# Altium project Q24_Steering_Wheel_Pi.PrjPcb
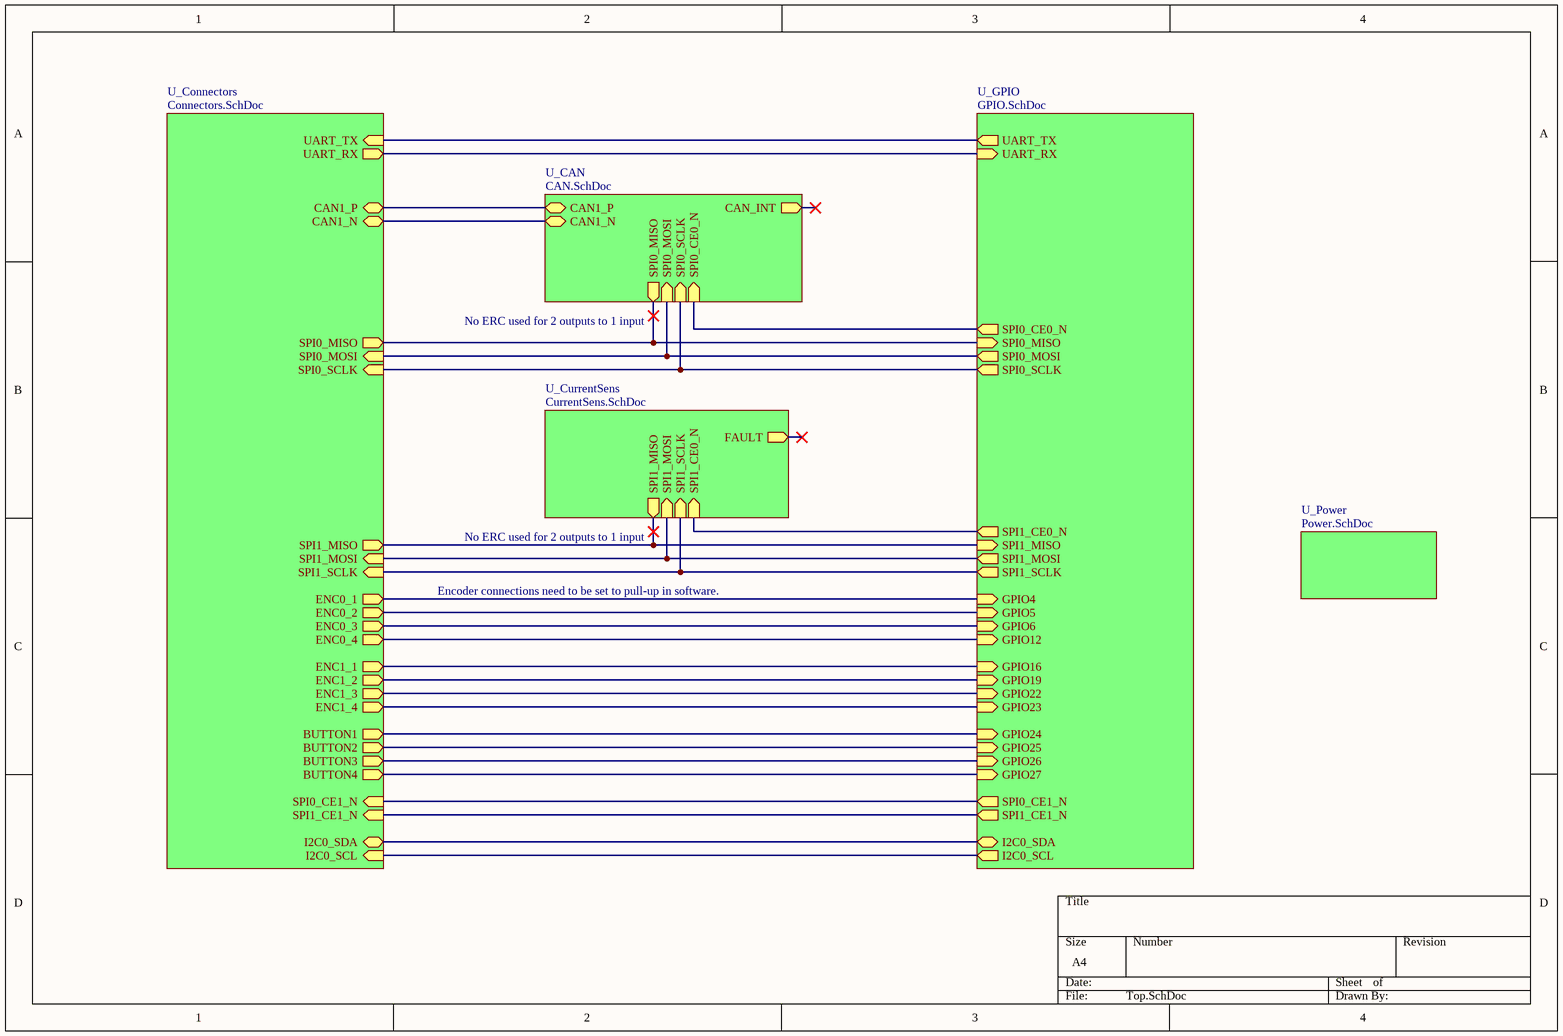
[diagram p0: Top.SchDoc]
6 sheets, 45 parts. Net scope: hierarchical (ports join the sheet entries above them; power ports are global).
Board file: RPI 3.PcbDoc
Sheets:
  Top.SchDoc
    U_GPIO = GPIO.SchDoc
    U_CAN = CAN.SchDoc
    U_CurrentSens = CurrentSens.SchDoc
    U_Power = Power.SchDoc
    U_Connectors = Connectors.SchDoc

## Sheet Top.SchDoc
size A4; SheetNumber: 1; SheetTotal: 6

### Sub-sheets
U_CAN = CAN.SchDoc: CAN1_P (bidir), CAN1_N (bidir), CAN_INT (out), SPI0_CE0_N (in), SPI0_SCLK (in), SPI0_MOSI (in), SPI0_MISO (out)
U_Connectors = Connectors.SchDoc: ENC0_1 (out), ENC0_2 (out), ENC0_4 (out), ENC0_3 (out), ENC1_1 (out), ENC1_3 (out), ENC1_2 (out), ENC1_4 (out), BUTTON1 (out), BUTTON3 (out), BUTTON4 (out), BUTTON2 (out), I2C0_SDA (bidir), I2C0_SCL (in), CAN1_P (bidir), CAN1_N (bidir), UART_TX (in), UART_RX (out), SPI0_MOSI (in), SPI0_MISO (out), SPI0_CE1_N (in), SPI0_SCLK (in), SPI1_SCLK (in), SPI1_CE1_N (in), SPI1_MISO (out), SPI1_MOSI (in)
U_CurrentSens = CurrentSens.SchDoc: SPI1_MISO (out), SPI1_CE0_N (in), SPI1_SCLK (in), SPI1_MOSI (in), FAULT (out)
U_GPIO = GPIO.SchDoc: I2C0_SDA (bidir), I2C0_SCL (out), GPIO4 (in), SPI1_CE1_N (out), GPIO27 (in), GPIO22 (in), SPI0_MOSI (out), SPI0_MISO (in), SPI0_SCLK (out), GPIO26 (in), GPIO19 (in), GPIO6 (in), GPIO5 (in), SPI1_MISO (in), SPI1_MOSI (out), SPI0_CE1_N (out), SPI1_SCLK (out), SPI0_CE0_N (out), UART_RX (in), UART_TX (out), GPIO23 (in), GPIO24 (in), GPIO25 (in), GPIO12 (in), GPIO16 (in), SPI1_CE0_N (out)
U_Power = Power.SchDoc: no entries

### Nets
CAN1_N: sheet U_CAN/CAN1_N, sheet U_Connectors/CAN1_N
CAN1_P: sheet U_CAN/CAN1_P, sheet U_Connectors/CAN1_P
GPIO4: sheet U_GPIO/GPIO4, sheet U_Connectors/ENC0_1
GPIO5: sheet U_GPIO/GPIO5, sheet U_Connectors/ENC0_2
GPIO6: sheet U_GPIO/GPIO6, sheet U_Connectors/ENC0_3
GPIO12: sheet U_GPIO/GPIO12, sheet U_Connectors/ENC0_4
GPIO16: sheet U_GPIO/GPIO16, sheet U_Connectors/ENC1_1
GPIO19: sheet U_GPIO/GPIO19, sheet U_Connectors/ENC1_2
GPIO22: sheet U_GPIO/GPIO22, sheet U_Connectors/ENC1_3
GPIO23: sheet U_GPIO/GPIO23, sheet U_Connectors/ENC1_4
GPIO24: sheet U_GPIO/GPIO24, sheet U_Connectors/BUTTON1
GPIO25: sheet U_GPIO/GPIO25, sheet U_Connectors/BUTTON2
GPIO26: sheet U_GPIO/GPIO26, sheet U_Connectors/BUTTON3
GPIO27: sheet U_GPIO/GPIO27, sheet U_Connectors/BUTTON4
I2C0_SCL: sheet U_GPIO/I2C0_SCL, sheet U_Connectors/I2C0_SCL
I2C0_SDA: sheet U_GPIO/I2C0_SDA, sheet U_Connectors/I2C0_SDA
SPI0_CE0_N: sheet U_GPIO/SPI0_CE0_N, sheet U_CAN/SPI0_CE0_N
SPI0_CE1_N: sheet U_GPIO/SPI0_CE1_N, sheet U_Connectors/SPI0_CE1_N
SPI0_MISO: sheet U_GPIO/SPI0_MISO, sheet U_CAN/SPI0_MISO, sheet U_Connectors/SPI0_MISO
SPI0_MOSI: sheet U_GPIO/SPI0_MOSI, sheet U_CAN/SPI0_MOSI, sheet U_Connectors/SPI0_MOSI
SPI0_SCLK: sheet U_GPIO/SPI0_SCLK, sheet U_CAN/SPI0_SCLK, sheet U_Connectors/SPI0_SCLK
SPI01_CE0_N: sheet U_GPIO/SPI1_CE0_N, sheet U_CurrentSens/SPI1_CE0_N
SPI1_CE1_N: sheet U_GPIO/SPI1_CE1_N, sheet U_Connectors/SPI1_CE1_N
SPI1_MISO: sheet U_GPIO/SPI1_MISO, sheet U_CurrentSens/SPI1_MISO, sheet U_Connectors/SPI1_MISO
SPI1_MOSI: sheet U_GPIO/SPI1_MOSI, sheet U_CurrentSens/SPI1_MOSI, sheet U_Connectors/SPI1_MOSI
SPI1_SCLK: sheet U_GPIO/SPI1_SCLK, sheet U_CurrentSens/SPI1_SCLK, sheet U_Connectors/SPI1_SCLK
UART_RX: sheet U_GPIO/UART_RX, sheet U_Connectors/UART_RX
UART_TX: sheet U_GPIO/UART_TX, sheet U_Connectors/UART_TX

### Notes on the sheet
- No ERC used for 2 outputs to 1 input
- Encoder connections need to be set to pull-up in software.

## Sheet GPIO.SchDoc
size A4; SheetNumber: 6; SheetTotal: 6
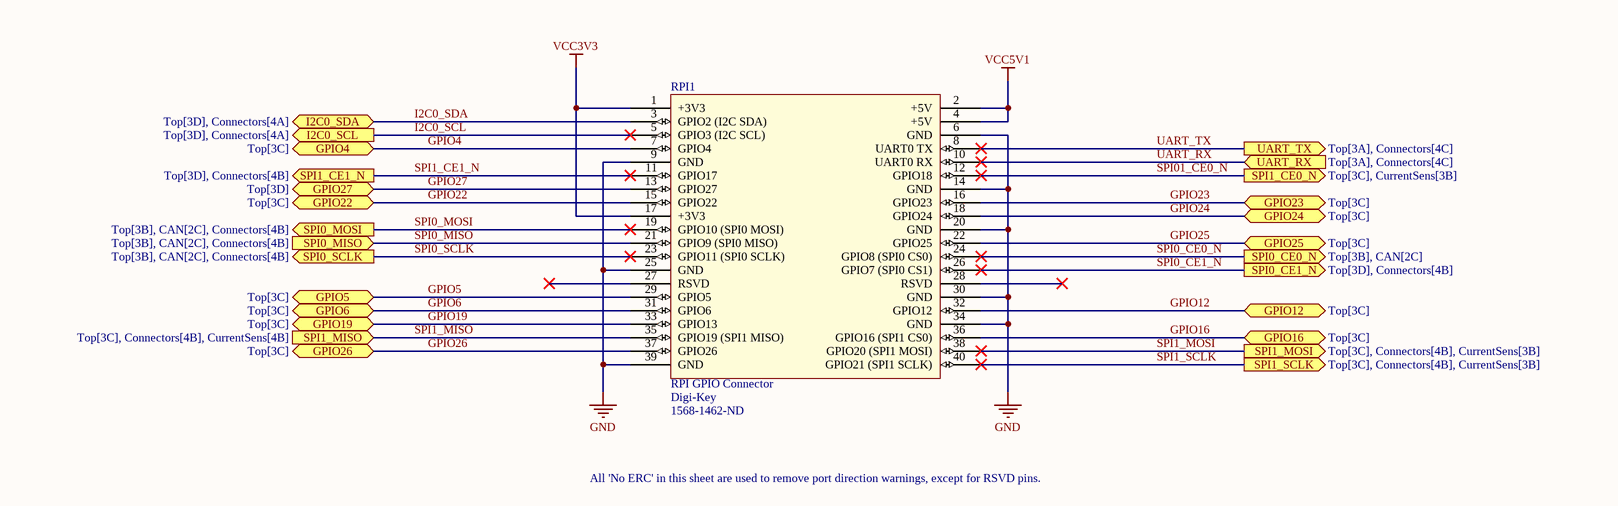
[diagram p1: GPIO.SchDoc]

### Parts
RPI1  RPI GPIO Connector  Supplier 1: Digi-Key  Supplier Part Number 1: 1568-1462-ND  [rpi]

### Ports
GPIO4 (bidir, see Top[3C]), GPIO5 (bidir, see Top[3C]), GPIO6 (bidir, see Top[3C]), GPIO12 (bidir, see Top[3C]), GPIO16 (bidir, see Top[3C]), GPIO19 (bidir, see Top[3C]), GPIO22 (bidir, see Top[3C]), GPIO23 (bidir, see Top[3C]), GPIO24 (bidir, see Top[3C]), GPIO25 (bidir, see Top[3C]), GPIO26 (bidir, see Top[3C]), GPIO27 (bidir, see Top[3D]), I2C0_SCL (out, see Top[3D], Connectors[4A]), I2C0_SDA (bidir, see Top[3D], Connectors[4A]), SPI0_CE0_N (out, see Top[3B], CAN[2C]), SPI0_CE1_N (out, see Top[3D], Connectors[4B]), SPI0_MISO (in, see Top[3B], CAN[2C], Connectors[4B]), SPI0_MOSI (out, see Top[3B], CAN[2C], Connectors[4B]), SPI0_SCLK (out, see Top[3B], CAN[2C], Connectors[4B]), SPI1_CE0_N (out, see Top[3C], CurrentSens[3B]), SPI1_CE1_N (out, see Top[3D], Connectors[4B]), SPI1_MISO (in, see Top[3C], Connectors[4B], CurrentSens[4B]), SPI1_MOSI (out, see Top[3C], Connectors[4B], CurrentSens[3B]), SPI1_SCLK (out, see Top[3C], Connectors[4B], CurrentSens[3B]), UART_RX (in, see Top[3A], Connectors[4C]), UART_TX (out, see Top[3A], Connectors[4C])

### Nets
GND: RPI1.6(GND) RPI1.9(GND) RPI1.14(GND) RPI1.20(GND) RPI1.25(GND) RPI1.30(GND) RPI1.34(GND) RPI1.39(GND)
VCC3V3: RPI1.1(+3V3) RPI1.17(+3V3)
VCC5V1: RPI1.2(+5V) RPI1.4(+5V)
GPIO4: RPI1.7(GPIO4) ; port GPIO4
GPIO5: RPI1.29(GPIO5) ; port GPIO5
GPIO6: RPI1.31(GPIO6) ; port GPIO6
GPIO12: RPI1.32(GPIO12) ; port GPIO12
GPIO16: RPI1.36(GPIO16_(SPI1_CS0)) ; port GPIO16
GPIO19: RPI1.33(GPIO13) ; port GPIO19
GPIO22: RPI1.15(GPIO22) ; port GPIO22
GPIO23: RPI1.16(GPIO23) ; port GPIO23
GPIO24: RPI1.18(GPIO24) ; port GPIO24
GPIO25: RPI1.22(GPIO25) ; port GPIO25
GPIO26: RPI1.37(GPIO26) ; port GPIO26
GPIO27: RPI1.13(GPIO27) ; port GPIO27
I2C0_SCL: RPI1.5(GPIO3_(I2C_SCL)) ; port I2C0_SCL
I2C0_SDA: RPI1.3(GPIO2_(I2C_SDA)) ; port I2C0_SDA
SPI0_CE0_N: RPI1.24(GPIO8_(SPI0_CS0)) ; port SPI0_CE0_N
SPI0_CE1_N: RPI1.26(GPIO7_(SPI0_CS1)) ; port SPI0_CE1_N
SPI0_MISO: RPI1.21(GPIO9_(SPI0_MISO)) ; port SPI0_MISO
SPI0_MOSI: RPI1.19(GPIO10_(SPI0_MOSI)) ; port SPI0_MOSI
SPI0_SCLK: RPI1.23(GPIO11_(SPI0_SCLK)) ; port SPI0_SCLK
SPI01_CE0_N: RPI1.12(GPIO18) ; port SPI1_CE0_N
SPI1_CE1_N: RPI1.11(GPIO17) ; port SPI1_CE1_N
SPI1_MISO: RPI1.35(GPIO19_(SPI1_MISO)) ; port SPI1_MISO
SPI1_MOSI: RPI1.38(GPIO20_(SPI1_MOSI)) ; port SPI1_MOSI
SPI1_SCLK: RPI1.40(GPIO21_(SPI1_SCLK)) ; port SPI1_SCLK
UART_RX: RPI1.10(UART0_RX) ; port UART_RX
UART_TX: RPI1.8(UART0_TX) ; port UART_TX

Not connected (* = marked no-connect by the designer): RPI1 27(RSVD)* 28(RSVD)*

### Notes on the sheet
- All 'No ERC' in this sheet are used to remove port direction warnings, except for RSVD pins.

### Library data of the parts
RPI1 = rpi connector: GPIO Header for Raspberry Pi A+/B+/Pi 2/Pi 3 - 2x20; Manufacturer: SparkFun Electronics; Manufacturer Part Number: PRT-14017; Nils Minor: author; nilsminor@web.de: mail; RoHS: RoHS Compliant; Category: Development Boards, Kits, Programmers; Stock 1: 150; Pricing 1: 1=1.84 (EUR); Part Status: Active; Accessory Type: Connector; For Use With/Related Products: Raspberry Pi; ComponentLink1URL: https://cdn.sparkfun.com/datasheets/Dev/RaspberryPi/12313.pdf; ComponentLink1Description: https://cdn.sparkfun.com/datasheets/Dev/RaspberryPi/12313.pdf

## Sheet CAN.SchDoc
size A4; SheetNumber: 3; SheetTotal: 6
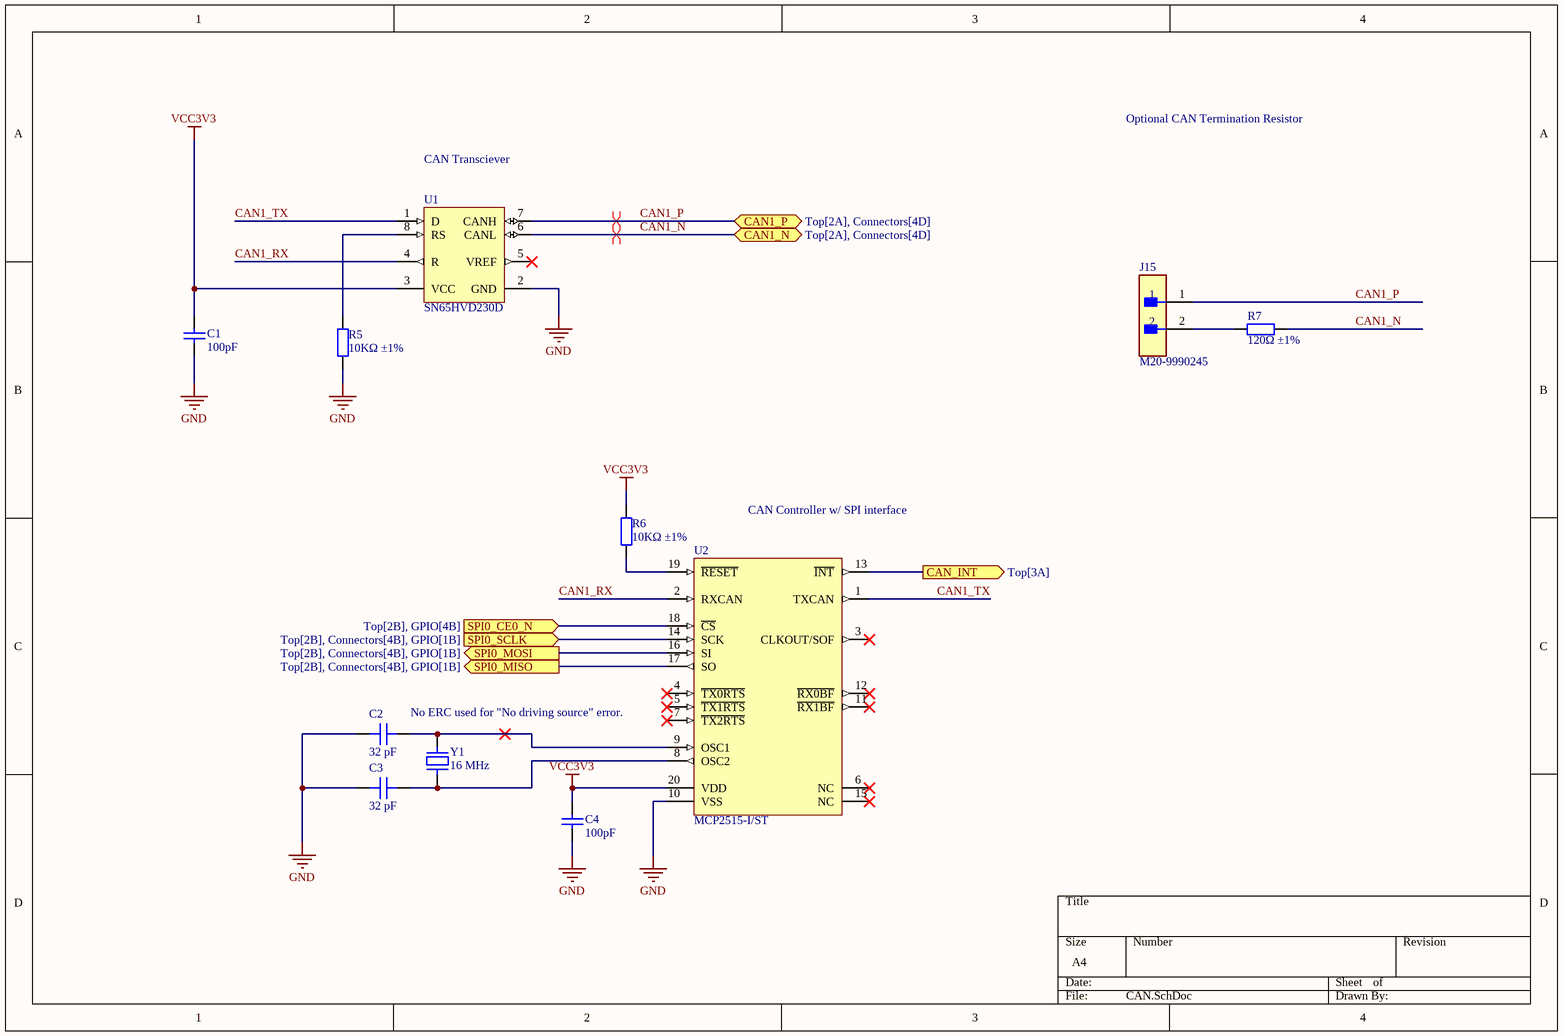
[diagram p2: CAN.SchDoc]

### Parts
C1  100pF  [0402_C]
C2  32 pF  [CAP 0603_1608]
C3  32 pF  [CAP 0603_1608]
C4  100pF  [0402_C]
J15  M20-9990245  [FP-M20-9990245-MFG]
R5  10KΩ ±1%  [0402_R]
R6  10KΩ ±1%  [0402_R]
R7  120Ω ±1%  [0603_R]
U1  SN65HVD230D  [D0008A_M]
U2  MCP2515-I/ST  [TSSOP-ST20_N]
Y1  16 MHz  [ABRACON ABLS]

### Ports
CAN1_N (bidir, see Top[2A], Connectors[4D]), CAN1_P (bidir, see Top[2A], Connectors[4D]), CAN_INT (out, see Top[3A]), SPI0_CE0_N (in, see Top[2B], GPIO[4B]), SPI0_MISO (out, see Top[2B], Connectors[4B], GPIO[1B]), SPI0_MOSI (out, see Top[2B], Connectors[4B], GPIO[1B]), SPI0_SCLK (in, see Top[2B], Connectors[4B], GPIO[1B])

### Nets
GND: C1.1 C2.1 C3.1 C4.1 R5.1 U1.2(GND) U2.10(VSS)
VCC3V3: C1.2 C4.2 R6.2 U1.3(VCC) U2.20(VDD)
CAN1_N: R7.1 U1.6(CANL) ; port CAN1_N
CAN1_P: J15.1 U1.7(CANH) ; port CAN1_P
CAN1_RX: U1.4(R) U2.2(RXCAN)
CAN1_TX: U1.1(D) U2.1(TXCAN)
SPI0_CE0_N: U2.18(~{CS}) ; port SPI0_CE0_N
SPI0_MISO: U2.17(SO) ; port SPI0_MISO
SPI0_MOSI: U2.16(SI) ; port SPI0_MOSI
SPI0_SCLK: U2.14(SCK) ; port SPI0_SCLK
NetC2_2: C2.2 U2.9(OSC1) Y1.2
NetC3_2: C3.2 U2.8(OSC2) Y1.1
NetJ15_2: J15.2 R7.2
NetR5_2: R5.2 U1.8(RS)
NetR6_1: R6.1 U2.19(~{RESET})
NetU2_13: U2.13(~{INT}) ; port CAN_INT

Not connected (* = marked no-connect by the designer): U1 5(VREF)*; U2 3(CLKOUT/SOF)* 4(~{TX0RTS})* 5(~{TX1RTS})* 6(NC)* 7(~{TX2RTS})* 11(~{RX1BF})* 12(~{RX0BF})* 15(NC)*

### Layout directives
differential pair: CAN1_N, CAN1_P

### Notes on the sheet
- CAN Transciever
- Optional CAN Termination Resistor
- CAN Controller w/ SPI interface
- No ERC used for "No driving source" error.

### Library data of the parts
C1 C4 = 0402 100pF (101) 5% 50V: Chip capacitors; Manufacturer: Guangdong Fenghua Advanced Tech; PartNumber: 0402CG101J500NT; Tolerance: 5%; Voltage: 50V; ComponentLink1Description: Supplier link; ComponentLink1URL: http://www.szlcsc.com/product/details_1898.html; Package: 0402; Supplier: LC; SuppliersPartNumber: C1546; Capacitance: 100pF
C2 C3 = 06031A320FAT2A: CAP CER 32PF 100V C0G/NP0 0603; manufacturer: KYOCERA AVX; Temperature Coefficient: C0G, NP0; Tolerance: ±1%; Part Number: 06031A320FAT2A; Value: 32 pF; Applications: General Purpose; Capacitance: 32 pF; componentlink1description: Datasheet; componentlink1url: https://datasheets.kyocera-avx.com/C0GNP0-Dielectric.pdf; componentlink2description: DigiKey Link; componentlink2url: https://www.digikey.com/en/products/detail/kyocera-avx/06031A320FAT2A/1598465; Device Package: 0603 (1608 Metric); lastupdated: 2023-12-31 8:09:49 PM; Lifecycle Status: Active; Minimum Order: 1; Mounting Type: Surface Mount, MLCC; Operating Temperature: -55°C ~ 125°C; Package / Case: 0603 (1608 Metric); packaging: TapeAndReel; partid: 40205; Part Status: Active; price: 0.07; series: -; Size / Dimension: 0.063" L x 0.032" W (1.60mm x 0.81mm); Supplier 1: DigiKey; Supplier Part Number 1: 478-06031A320FAT2ACT-ND; Thickness (Max): 0.035" (0.90mm); Voltage - Rated: 100V
J15 = CMP-15831-000105-1: CONN HEADER VERT 2POS 2.54MM; Working Voltage: 750V; Gender: Male; Number of Poles: 2; Current Rating: 3A; Mated Stacking Heights: 16.54mm; Contact Resistance: 25mR; Connector Type: Male Pin; Insulation Resistance: 10GR; Mating Cycles: 300; Voltage: 50V; Flammability Rating: UL94 V-0; Pitch: 2.54mm; Series: M20; Number of Contacts: 2; Height: 0.12inch; Min Operating Temperature: -40°C; Contact Finish - Mating: GOLD; Number of Positions: 2; Number of Rows: 1; Packaging: Bulk; Package Quantity: 1000; Voltage Rating (AC): 750V; Current: 3A; Mount: Through Hole; Case/Package: SIL; Orientation: Straight; Contact Shape: Square; Weight: 0.25lb; Radiation Hardening: No; Fastening Type: Pull; Length: 5.08mm; Depth: 2.54mm; Contact Mating Length: 0.24inch; Housing Material: Nylon; Reach SVHC Compliant: Yes; Insulation Material: Nylon; Color: Black; Width: 0.25inch; Insulation Color: Black; Contact Material: Brass; Contact Type: Male Pin; Termination: Solder; Max Operating Temperature: 105°C; Contact Plating: Gold; Housing Color: Black; Max Current Rating: 3A; Lead Pitch: 2.54mm
R5 R6 = 0402 10K (1002) 1%: Chip resistor; Manufacturer: Uniroyal Elec; PartNumber: 0402WGF1002TCE; Power: 1/16W; ComponentLink1Description: Supplier link; ComponentLink1URL: http://www.szlcsc.com/product/details_26487.html; Package: 0402; Supplier: LC; SuppliersPartNumber: C25744; Resistance: 10KΩ; Tolerance: 1%
R7 = 0603 120R (1200) 1%: Chip resistor; Manufacturer: Uniroyal Elec; PartNumber: 0603WAF1200T5E; Power: 1/10W; ComponentLink1Description: Supplier link; ComponentLink1URL: http://www.szlcsc.com/product/details_23514.html; Package: 0603; Supplier: LC; SuppliersPartNumber: C22787; Resistance: 120Ω; Tolerance: 1%
U1 = CMP-0315-00046-3: CAN Bus Transceiver, 3.3 V, -40 to 85 degC, 8-Pin SOIC (D), Green (RoHS & no Sb/Br), Tube; Supply Voltage Min: 3 V; Supply Voltage Max: 3.6 V; PartNumber: SN65HVD230D; ComponentLink2URL: http://www.ti.com/general/docs/lit/getliterature.tsp?genericGeneric Part Number=SN65HVD230&fileType=pdf; DatasheetVersion: SLOS346N; Generic Part Number: SN65HVD230; Packing: Tube; Temperature Min: -40 degC; Temperature Max: 85 degC; ComponentLink1Description: Manufacturer URL; Mounting Technology: Surface Mount; RoHS: TRUE; ComponentLink1URL: http://www.ti.com/; ComponentLink2Description: Datasheet; PackageDescription: 8-Pin Plastic Small Outline, Body 4.9 x 3.9 mm, Pitch 1.27 mm
U2 = CMP-0186-00077-2: Stand-Alone CAN Controller With SPI Interface, 20-Pin TSSOP, Industrial Temperature; DatasheetVersion: revF, Oct-2010; ComponentLink1Description: Manufacturer URL; PackageDescription: 20-Lead Plastic Thin Shrink Small Outline (ST) - 4.4mm Body [TSSOP]; ComponentLink1URL: http://www.microchip.com/; RevisionNote: URLs added. DatasheetVersion updated.; PackageReference: TSSOP-ST20; Code_JEDEC: MO-153-AC; ComponentLink2Description: Datasheet; ComponentLink2URL: http://ww1.microchip.com/downloads/en/DeviceDoc/21801f.pdf; PackageVersion: revBB, Aug-2009; ComponentLink3URL: http://www.microchip.com/stellent/groups/techpub_sg/documents/packagingspec/en012702.pdf; ComponentLink3Description: Package Specification
Y1 = ABLS-16.000MHZ-D-3-Y-T: CRYSTAL 16.0000MHZ 18PF SMD; Manufacturer: Abracon LLC; ESR (Equivalent Series Resistance): 40 Ohms; Frequency Stability: ±30ppm; Frequency Tolerance: ±25ppm; Operating Mode: Fundamental; Part Number: ABLS-16.000MHZ-D-3-Y-T; ComponentLink1Description: Datasheet; ComponentLink1URL: https://abracon.com/Resonators/abls.pdf; ComponentLink2Description: DigiKey Link; ComponentLink2URL: https://www.digikey.com/en/products/detail/abracon-llc/ABLS-16-000MHZ-D-3-Y-T/9997790; Frequency: 16 MHz; Height - Seated (Max): 0.165" (4.20mm); LastUpdated: 2023-12-31 9:29:55 PM; Lifecycle Status: Active; Load Capacitance: 18pF; Minimum Order: 1; Mounting Type: Surface Mount; Operating Temperature: -40°C ~ 85°C; Package / Case: HC-49/US; Packaging: TapeAndReel; PartId: 74; Part Status: Active; Price: 0.09; Series: ABLS; Size / Dimension: 0.449" L x 0.185" W (11.40mm x 4.70mm); Supplier 1: DigiKey; Supplier Part Number 1: 535-14882-1-ND; Type: MHz Crystal; Value: 16 MHz

## Sheet CurrentSens.SchDoc
size A4; SheetNumber: 5; SheetTotal: 6
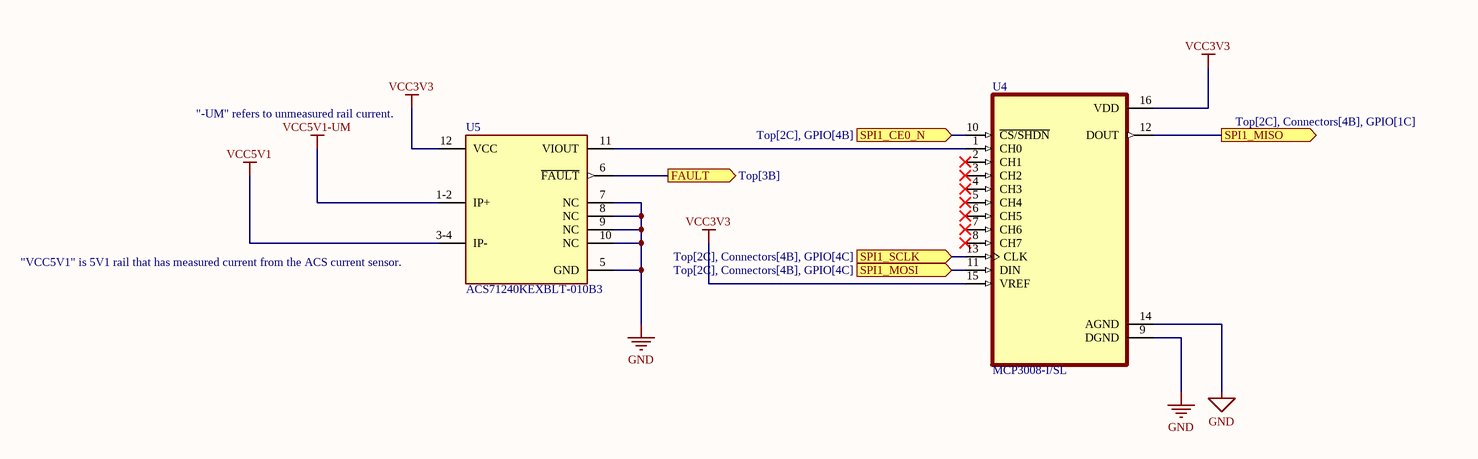
[diagram p3: CurrentSens.SchDoc]

### Parts
U4  MCP3008-I/SL  [SOIC127P600X175-16N]
U5  ACS71240KEXBLT-010B3  [FP-EXB-12-MFG]

### Ports
FAULT (out, see Top[3B]), SPI1_CE0_N (in, see Top[2C], GPIO[4B]), SPI1_MISO (out, see Top[2C], Connectors[4B], GPIO[1C]), SPI1_MOSI (in, see Top[2C], Connectors[4B], GPIO[4C]), SPI1_SCLK (in, see Top[2C], Connectors[4B], GPIO[4C])

### Nets
GND: U4.9(DGND) U4.14(AGND) U5.5(GND) U5.7(NC) U5.8(NC) U5.9(NC) U5.10(NC)
VCC3V3: U4.15(VREF) U4.16(VDD) U5.12(VCC)
VCC5V1: U5.3-4(IP-)
VCC5V1-UM: U5.1-2(IP+)
SPI01_CE0_N: U4.10(~{CS/SHDN}) ; port SPI1_CE0_N
SPI1_MISO: U4.12(DOUT) ; port SPI1_MISO
SPI1_MOSI: U4.11(DIN) ; port SPI1_MOSI
SPI1_SCLK: U4.13(CLK) ; port SPI1_SCLK
NetU4_1: U4.1(CH0) U5.11(VIOUT)
NetU5_6: U5.6(~{FAULT}) ; port FAULT

Not connected (* = marked no-connect by the designer): U4 2(CH1)* 3(CH2)* 4(CH3)* 5(CH4)* 6(CH5)* 7(CH6)* 8(CH7)*

### Notes on the sheet
- (near U5) "-UM" refers to unmeasured rail current.
- (near U5) "VCC5V1" is 5V1 rail that has measured current from the ACS current sensor.

### Library data of the parts
U4 = MCP3008-I/SL: 10 Bit Analog to Digital Converter 4, 8 Input 1 SAR 16-SOIC; MF: Microchip; Value: *; Price: None; Package: SOIC-16 Microchip; Check_prices: https://www.snapeda.com/parts/MCP3008-I/SL/Microchip/view-part/?ref=eda; Availability: In Stock; SnapEDA_Link: https://www.snapeda.com/parts/MCP3008-I/SL/Microchip/view-part/?ref=snap; MP: MCP3008-I/SL; Purchase-URL: https://pricing.snapeda.com/search/part/MCP3008-I/SL/?ref=eda
U5 = CMP-82923-000018-1: AUTOMOTIVE-GRADE, GALVANICALLY I

## Sheet Power.SchDoc
size A4; SheetNumber: 4; SheetTotal: 6
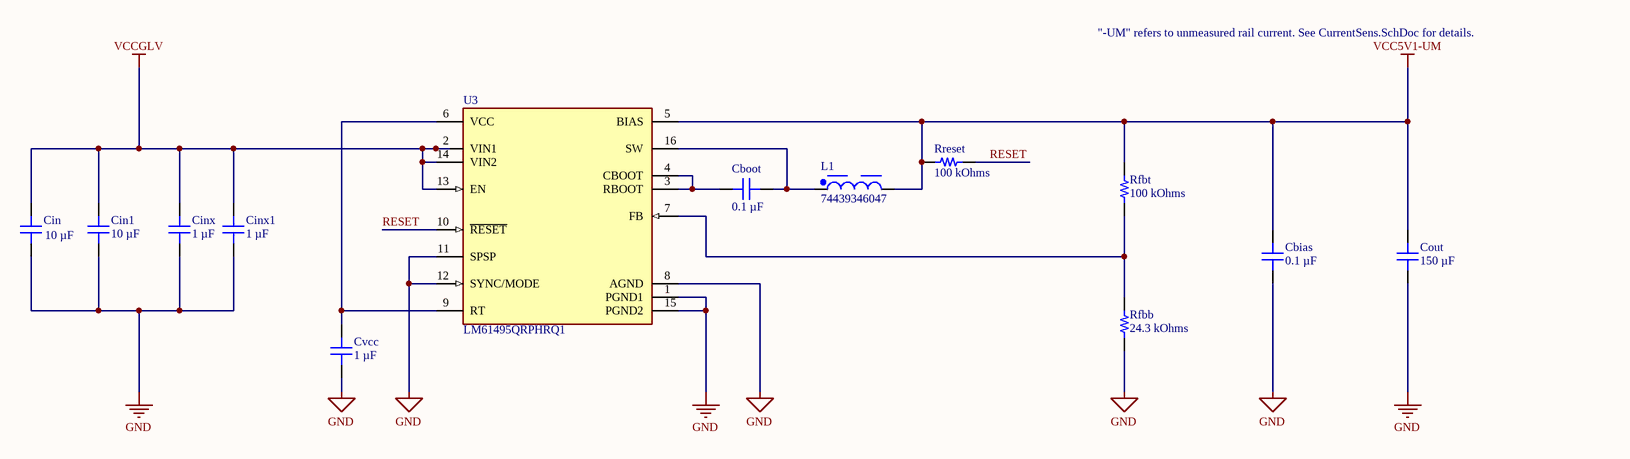
[diagram p4: Power.SchDoc]

### Parts
Cbias  0.1 µF  [CAP 0402_1005]
Cboot  0.1 µF  [CAP 0402_1005]
Cin  10 µF  [CAP 1210_3225 - 1MM]
Cin1  10 µF  [CAP 1210_3225 - 1MM]
Cinx  1 µF  [CAP 0603_1608]
Cinx1  1 µF  [CAP 0603_1608]
Cout  150 µF  [CAP 1210_3225 - 1MM]
Cvcc  1 µF  [CAP 0603_1608]
L1  74439346047  [WE-XHMI_6060_L6.65W6.45H5.8]
Rfbb  24.3 kOhms  [RES 0402_1005]
Rfbt  100 kOhms  [RES 0402_1005]
Rreset  100 kOhms  [RES 0402_1005]
U3  LM61495QRPHRQ1  [FP-RPH0016A-MFG]

### Nets
GND: Cbias.1 Cin.1 Cin1.1 Cinx.1 Cinx1.1 Cout.1 Cvcc.1 Rfbb.1 U3.1(PGND1) U3.8(AGND) U3.11(SPSP) U3.12(SYNC/MODE) U3.15(PGND2)
VCC5V1-UM: Cbias.2 Cout.2 L1.2 Rfbt.2 Rreset.1 U3.5(BIAS)
VCCGLV: Cin.2 Cin1.2 Cinx.2 Cinx1.2 U3.2(VIN1) U3.13(EN) U3.14(VIN2)
RESET: Rreset.2 U3.10(~{RESET})
NetCboot_1: Cboot.1 U3.3(RBOOT) U3.4(CBOOT)
NetCboot_2: Cboot.2 L1.1 U3.16(SW)
NetCvcc_2: Cvcc.2 U3.6(VCC) U3.9(RT)
NetRfbb_2: Rfbb.2 Rfbt.1 U3.7(FB)

### Notes on the sheet
- "-UM" refers to unmeasured rail current. See CurrentSens.SchDoc for details.

### Library data of the parts
Cbias = CL05B104KO5NFNC: CAP CER 0.1UF 16V X7R 0402; manufacturer: Samsung Electro-Mechanics; Tolerance: ±10%; Part Number: CL05B104KO5NFNC; Value: 0.1 µF; Applications: General Purpose; Capacitance: 0.1 µF; componentlink1description: Datasheet; componentlink1url: http://www.samsungsem.com/kr/support/product-search/mlcc/CL05B104KO5NFNC.jsp; componentlink2description: DigiKey Link; componentlink2url: https://www.digikey.com/en/products/detail/samsung-electro-mechanics/CL05B104KO5NFNC/3887166; Device Package: 0402 (1005 Metric); lastupdated: 2023-12-31 8:04:20 PM; Lifecycle Status: Active; Minimum Order: 1; Mounting Type: Surface Mount, MLCC; Operating Temperature: -55°C ~ 125°C; Package / Case: 0402 (1005 Metric); packaging: CutTape; partid: 11675; Part Status: Active; price: 0.01; series: CL; Size / Dimension: 0.039" L x 0.020" W (1.00mm x 0.50mm); Supplier 1: DigiKey; Supplier Part Number 1: 1276-1508-1-ND; Temperature Coefficient: X7R; Thickness (Max): 0.022" (0.55mm); Voltage - Rated: 16V
Cboot = CL05B104KP5NNNC: CAP CER 0.1UF 10V X7R 0402; manufacturer: Samsung Electro-Mechanics; Tolerance: ±10%; Part Number: CL05B104KP5NNNC; Value: 0.1 µF; Applications: General Purpose; Capacitance: 0.1 µF; componentlink1description: Datasheet; componentlink1url: http://www.samsungsem.com/kr/support/product-search/mlcc/CL05B104KP5NNNC.jsp; componentlink2description: DigiKey Link; componentlink2url: https://www.digikey.com/en/products/detail/samsung-electro-mechanics/CL05B104KP5NNNC/3886660; Device Package: 0402 (1005 Metric); lastupdated: 2023-12-31 8:04:29 PM; Lifecycle Status: Active; Minimum Order: 1; Mounting Type: Surface Mount, MLCC; Operating Temperature: -55°C ~ 125°C; Package / Case: 0402 (1005 Metric); packaging: CutTape; partid: 6068; Part Status: Active; price: 0.01; series: CL; Size / Dimension: 0.039" L x 0.020" W (1.00mm x 0.50mm); Supplier 1: DigiKey; Supplier Part Number 1: 1276-1002-1-ND; Temperature Coefficient: X7R; Thickness (Max): 0.022" (0.55mm); Voltage - Rated: 10V
Cin Cin1 = GRM32ER71H106KA12L: CAP CER 10UF 50V X7R 1210; manufacturer: Murata Electronics; Tolerance: ±10%; Part Number: GRM32ER71H106KA12L; Value: 10 µF; Applications: General Purpose; Capacitance: 10 µF; componentlink1description: Datasheet; componentlink1url: https://www.murata.com/~/media/webrenewal/support/library/catalog/products/capacitor/mlcc/c02e.ashx?la=en-us; componentlink2description: DigiKey Link; componentlink2url: https://www.digikey.com/en/products/detail/murata-electronics/GRM32ER71H106KA12L/2548481; Device Package: 1210 (3225 Metric); lastupdated: 2023-12-31 8:40:05 PM; Lifecycle Status: Active; Minimum Order: 1; Mounting Type: Surface Mount, MLCC; Operating Temperature: -55°C ~ 125°C; Package / Case: 1210 (3225 Metric); packaging: TapeAndReel; partid: 49713; Part Status: Active; price: 0.34; series: GRM; Size / Dimension: 0.126" L x 0.098" W (3.20mm x 2.50mm); Supplier 1: DigiKey; Supplier Part Number 1: 490-6544-1-ND; Temperature Coefficient: X7R; Thickness (Max): 0.106" (2.70mm); Voltage - Rated: 50V
Cinx Cinx1 = C1608X5R1H105K080AB: CAP CER 1UF 50V X5R 0603; manufacturer: TDK Corporation; Tolerance: ±10%; Part Number: C1608X5R1H105K080AB; Value: 1 µF; Applications: General Purpose; Capacitance: 1 µF; componentlink1description: Datasheet; componentlink1url: https://product.tdk.com/info/en/catalog/datasheets/mlcc_commercial_general_en.pdf?ref_disty=digikey; componentlink2description: DigiKey Link; componentlink2url: https://www.digikey.com/en/products/detail/tdk-corporation/C1608X5R1H105K080AB/2732903; Device Package: 0603 (1608 Metric); Features: Low ESL; lastupdated: 2023-12-31 8:10:04 PM; Lifecycle Status: Active; Minimum Order: 1; Mounting Type: Surface Mount, MLCC; Operating Temperature: -55°C ~ 85°C; Package / Case: 0603 (1608 Metric); packaging: TapeAndReel; partid: 36337; Part Status: Active; price: 0.02; series: C; Size / Dimension: 0.063" L x 0.031" W (1.60mm x 0.80mm); Supplier 1: DigiKey; Supplier Part Number 1: 445-7468-1-ND; Temperature Coefficient: X5R; Thickness (Max): 0.035" (0.90mm); Voltage - Rated: 50V
Cout = CL32A157MQVNNNE: CAP CER 150UF 6.3V X5R 1210; manufacturer: Samsung Electro-Mechanics; Tolerance: ±20%; Part Number: CL32A157MQVNNNE; Value: 150 µF; Applications: General Purpose; Capacitance: 150 µF; componentlink1description: Datasheet; componentlink1url: http://www.samsungsem.com/kr/support/product-search/mlcc/CL32A157MQVNNNE.jsp; componentlink2description: DigiKey Link; componentlink2url: https://www.digikey.com/en/products/detail/samsung-electro-mechanics/CL32A157MQVNNNE/3889025; Device Package: 1210 (3225 Metric); lastupdated: 2023-12-31 8:40:03 PM; Lifecycle Status: Active; Minimum Order: 1; Mounting Type: Surface Mount, MLCC; Operating Temperature: -55°C ~ 85°C; Package / Case: 1210 (3225 Metric); packaging: TapeAndReel; partid: 23856; Part Status: Active; price: 0.35; series: CL; Size / Dimension: 0.126" L x 0.098" W (3.20mm x 2.50mm); Supplier 1: DigiKey; Supplier Part Number 1: 1276-3367-1-ND; Temperature Coefficient: X5R; Thickness (Max): 0.110" (2.80mm); Voltage - Rated: 6.3V
Cvcc = KGM15BR50J105KT: CAP CER 1UF 6.3V X5R 0603; manufacturer: KYOCERA AVX; Tolerance: ±10%; Part Number: KGM15BR50J105KT; Value: 1 µF; Applications: General Purpose; Capacitance: 1 µF; componentlink1description: Datasheet; componentlink1url: https://datasheets.kyocera-avx.com/cx5r.pdf; componentlink2description: DigiKey Link; componentlink2url: https://www.digikey.com/en/products/detail/kyocera-avx/KGM15BR50J105KT/717509; Device Package: 0603 (1608 Metric); lastupdated: 2023-12-31 8:09:09 PM; Lifecycle Status: Active; Minimum Order: 1; Mounting Type: Surface Mount, MLCC; Operating Temperature: -55°C ~ 85°C; Package / Case: 0603 (1608 Metric); packaging: TapeAndReel; partid: 53227; Part Status: Active; price: 0.02; series: KGM - X5R; Size / Dimension: 0.063" L x 0.031" W (1.60mm x 0.80mm); Supplier 1: DigiKey; Supplier Part Number 1: 478-KGM15BR50J105KTCT-ND; Temperature Coefficient: X5R; Thickness (Max): 0.037" (0.95mm); Voltage - Rated: 6.3V
L1 = CMP-207846-000039-2: FIXED IND 4.7UH 7.4A 13 MOHM; NexarPartId: 75811200; Test Frequency: 100kHz; Saturation Current: 6.5A; Inductance Tolerance: 20%; Self Resonant Frequency: 25MHz; Series Resistance: 13mΩ; Inductance: 4.7µH; Width: 6.45mm; Mount: Surface Mount; Ambient Temperature Range High: 85°C; Max Operating Temperature: 125°C; RMS Current (Irms): 7.4A; Length: 6.65mm; Height: 6.1mm; RoHS: Compliant; REACH SVHC: No SVHC; DC Resistance (DCR): 13mΩ; Current Rating: 7.4A; Tolerance: 20%; Ambient Temperature Range Low: -40°C; Min Operating Temperature: -40°C; Composition: Wirewound; Number of Pins: 2
Rfbb = CRCW040224K3FKTD: RES SMD 24.3K OHM 1% 1/16W 0402; Manufacturer: Vishay Dale; Power (Watts): 0.063W, 1/16W; Temperature Coefficient: ±100ppm/°C; Part Number: CRCW040224K3FKTD; Value: 24.3 kOhms; ComponentLink1Description: Datasheet; ComponentLink1URL: https://www.vishay.com/docs/20008/dcrcw.pdf; ComponentLink2Description: DigiKey Link; ComponentLink2URL: https://www.digikey.com/en/products/detail/vishay-dale/CRCW040224K3FKTD/1221116; Composition: Thick Film; Device Package: 0402 (1005 Metric); Features: Automotive AEC-Q200; Height - Seated (Max): 0.016" (0.40mm); LastUpdated: 2023-12-31 8:26:27 PM; Lifecycle Status: Active; Minimum Order: 1; Number of Terminations: 2; Operating Temperature: -55°C ~ 155°C; Package / Case: 0402 (1005 Metric); Packaging: TapeAndReel; PartId: 81813; Price: 0.01; Ratings: AEC-Q200; Resistance: 24.3 kOhms; Series: CRCW; Size / Dimension: 0.039" L x 0.020" W (1.00mm x 0.50mm); Supplier 1: DigiKey; Supplier Part Number 1: 541-CRCW040224K3FKTDCT-ND; Supplier Device Package: 0402; Tolerance: ±1%
Rfbt Rreset = CRCW0402100KFKED: RES SMD 100K OHM 1% 1/16W 0402; Manufacturer: Vishay Dale; Power (Watts): 0.063W, 1/16W; Temperature Coefficient: ±100ppm/°C; Part Number: CRCW0402100KFKED; Value: 100 kOhms; ComponentLink1Description: Datasheet; ComponentLink1URL: http://www.vishay.com/docs/20035/dcrcwe3.pdf; ComponentLink2Description: DigiKey Link; ComponentLink2URL: https://www.digikey.com/en/products/detail/vishay-dale/CRCW0402100KFKED/1178235; Composition: Thick Film; Device Package: 0402 (1005 Metric); Features: Automotive AEC-Q200; Height - Seated (Max): 0.016" (0.40mm); LastUpdated: 2023-12-31 8:27:39 PM; Lifecycle Status: Active; Minimum Order: 1; Number of Terminations: 2; Operating Temperature: -55°C ~ 155°C; Package / Case: 0402 (1005 Metric); Packaging: CutTape; PartId: 11959; Part Status: Active; Price: 0.01; Ratings: AEC-Q200; Resistance: 100 kOhms; Series: CRCW; Size / Dimension: 0.039" L x 0.020" W (1.00mm x 0.50mm); Supplier 1: DigiKey; Supplier Part Number 1: 541-100KLCT-ND; Supplier Device Package: 0402; Tolerance: ±1%
U3 = CMP-04918-000418-1: 10-A automotive buck converter optimized for power density and low EMI 16-VQFN-HR -40 to 150

## Sheet Connectors.SchDoc
size A4; SheetNumber: 2; SheetTotal: 6
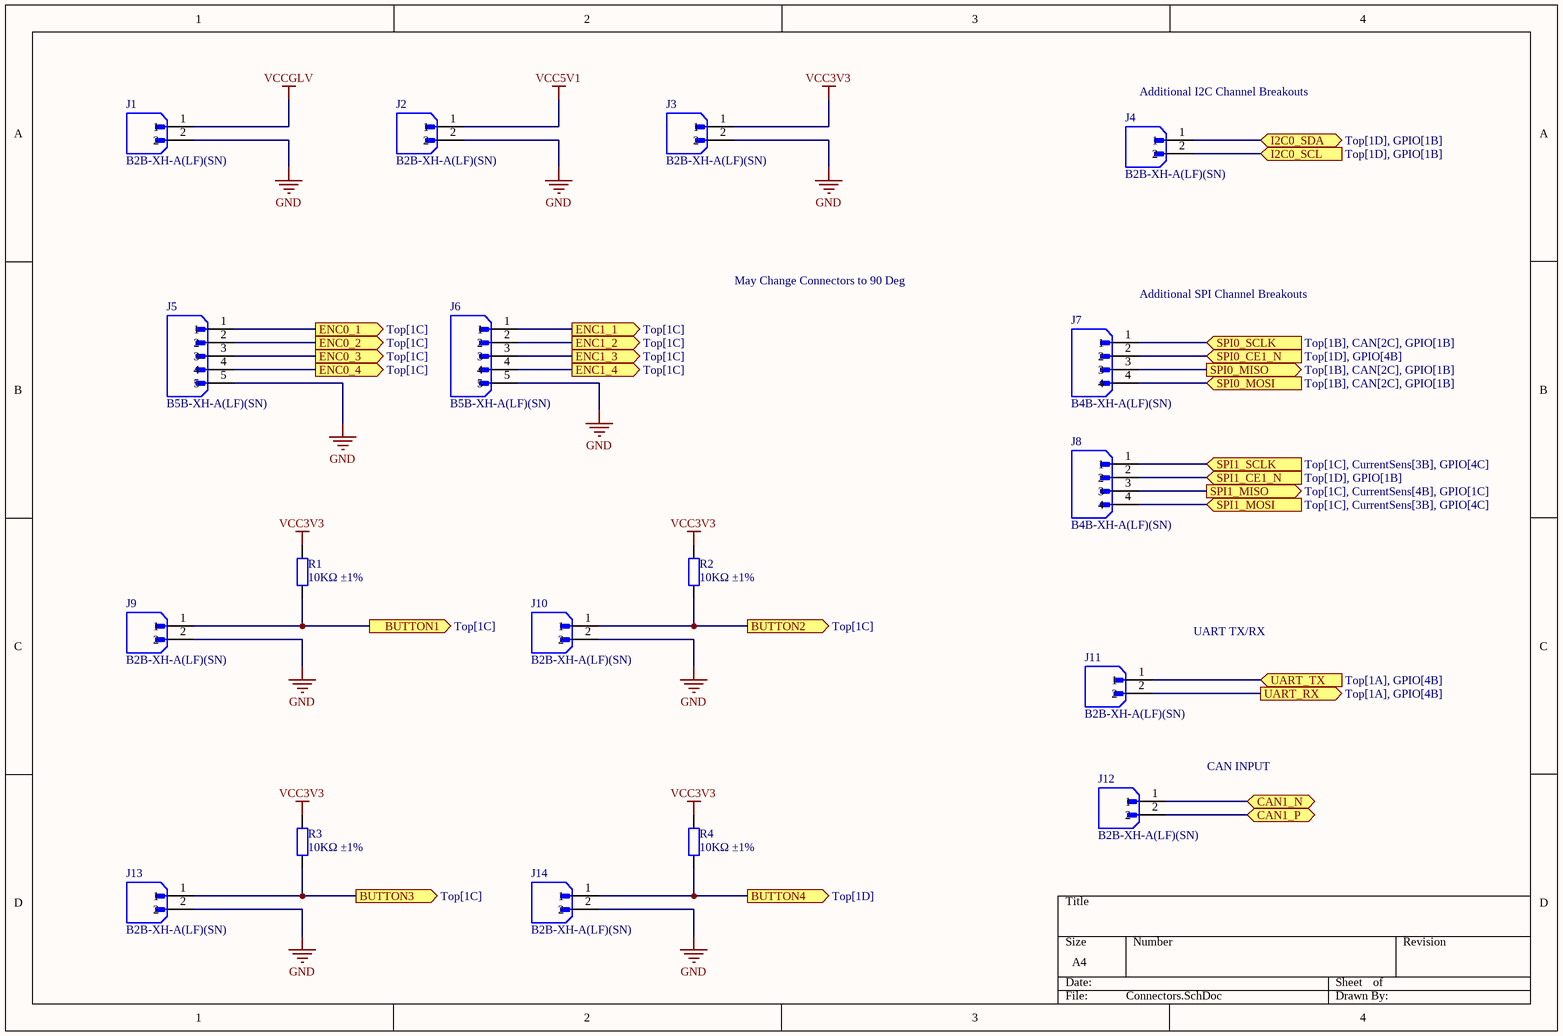
[diagram p5: Connectors.SchDoc]

### Parts
J1  B2B-XH-A(LF)(SN)  [JST_B2B-XH-A(LF)(SN)]
J2  B2B-XH-A(LF)(SN)  [JST_B2B-XH-A(LF)(SN)]
J3  B2B-XH-A(LF)(SN)  [JST_B2B-XH-A(LF)(SN)]
J4  B2B-XH-A(LF)(SN)  [JST_B2B-XH-A(LF)(SN)]
J5  B5B-XH-A(LF)(SN)  [JST_B5B-XH-A(LF)(SN)]
J6  B5B-XH-A(LF)(SN)  [JST_B5B-XH-A(LF)(SN)]
J7  B4B-XH-A(LF)(SN)  [JST_B4B-XH-A(LF)(SN)]
J8  B4B-XH-A(LF)(SN)  [JST_B4B-XH-A(LF)(SN)]
J9  B2B-XH-A(LF)(SN)  [JST_B2B-XH-A(LF)(SN)]
J10  B2B-XH-A(LF)(SN)  [JST_B2B-XH-A(LF)(SN)]
J11  B2B-XH-A(LF)(SN)  [JST_B2B-XH-A(LF)(SN)]
J12  B2B-XH-A(LF)(SN)  [JST_B2B-XH-A(LF)(SN)]
J13  B2B-XH-A(LF)(SN)  [JST_B2B-XH-A(LF)(SN)]
J14  B2B-XH-A(LF)(SN)  [JST_B2B-XH-A(LF)(SN)]
R1  10KΩ ±1%  [0402_R]
R2  10KΩ ±1%  [0402_R]
R3  10KΩ ±1%  [0402_R]
R4  10KΩ ±1%  [0402_R]

### Ports
BUTTON1 (out, see Top[1C]), BUTTON2 (out, see Top[1C]), BUTTON3 (out, see Top[1C]), BUTTON4 (out, see Top[1D]), CAN1_N (bidir, see Top[1A], CAN[2A]), CAN1_P (bidir, see Top[1A], CAN[2A]), ENC0_1 (out, see Top[1C]), ENC0_2 (out, see Top[1C]), ENC0_3 (out, see Top[1C]), ENC0_4 (out, see Top[1C]), ENC1_1 (out, see Top[1C]), ENC1_2 (out, see Top[1C]), ENC1_3 (out, see Top[1C]), ENC1_4 (out, see Top[1C]), I2C0_SCL (in, see Top[1D], GPIO[1B]), I2C0_SDA (bidir, see Top[1D], GPIO[1B]), SPI0_CE1_N (in, see Top[1D], GPIO[4B]), SPI0_MISO (out, see Top[1B], CAN[2C], GPIO[1B]), SPI0_MOSI (in, see Top[1B], CAN[2C], GPIO[1B]), SPI0_SCLK (in, see Top[1B], CAN[2C], GPIO[1B]), SPI1_CE1_N (in, see Top[1D], GPIO[1B]), SPI1_MISO (out, see Top[1C], CurrentSens[4B], GPIO[1C]), SPI1_MOSI (in, see Top[1C], CurrentSens[3B], GPIO[4C]), SPI1_SCLK (in, see Top[1C], CurrentSens[3B], GPIO[4C]), UART_RX (out, see Top[1A], GPIO[4B]), UART_TX (in, see Top[1A], GPIO[4B])

### Nets
GND: J1.2 J2.2 J3.2 J5.5 J6.5 J9.2 J10.2 J13.2 J14.2
VCC3V3: J3.1 R1.2 R2.2 R3.2 R4.2
VCC5V1: J2.1
VCCGLV: J1.1
CAN1_N: J12.1 ; port CAN1_N
CAN1_P: J12.2 ; port CAN1_P
GPIO4: J5.1 ; port ENC0_1
GPIO5: J5.2 ; port ENC0_2
GPIO6: J5.3 ; port ENC0_3
GPIO12: J5.4 ; port ENC0_4
GPIO16: J6.1 ; port ENC1_1
GPIO19: J6.2 ; port ENC1_2
GPIO22: J6.3 ; port ENC1_3
GPIO23: J6.4 ; port ENC1_4
GPIO24: J9.1 R1.1 ; port BUTTON1
GPIO25: J10.1 R2.1 ; port BUTTON2
GPIO26: J13.1 R3.1 ; port BUTTON3
GPIO27: J14.1 R4.1 ; port BUTTON4
I2C0_SCL: J4.2 ; port I2C0_SCL
I2C0_SDA: J4.1 ; port I2C0_SDA
SPI0_CE1_N: J7.2 ; port SPI0_CE1_N
SPI0_MISO: J7.3 ; port SPI0_MISO
SPI0_MOSI: J7.4 ; port SPI0_MOSI
SPI0_SCLK: J7.1 ; port SPI0_SCLK
SPI1_CE1_N: J8.2 ; port SPI1_CE1_N
SPI1_MISO: J8.3 ; port SPI1_MISO
SPI1_MOSI: J8.4 ; port SPI1_MOSI
SPI1_SCLK: J8.1 ; port SPI1_SCLK
UART_RX: J11.2 ; port UART_RX
UART_TX: J11.1 ; port UART_TX

### Notes on the sheet
- (near J4) Additional I2C Channel Breakouts
- May Change Connectors to 90 Deg
- (near J7) Additional SPI Channel Breakouts
- UART TX/RX
- CAN INPUT

### Library data of the parts
J1-J4 J9-J14 = B2B-XH-A(LF)(SN): Connector Header Through Hole 2 position 0.098 (2.50mm); MF: JST Sales; SnapEDA_Link: https://www.snapeda.com/parts/B2B-XH-A(LF)(SN)/JST+Sales+America+Inc./view-part/?ref=snap; Check_prices: https://www.snapeda.com/parts/B2B-XH-A(LF)(SN)/JST+Sales+America+Inc./view-part/?ref=eda; Value: *; MP: B2B-XH-A(LF)(SN); Package: None
J5 J6 = B5B-XH-A(LF)(SN): Connector Header Through Hole 5 position 0.098 (2.50mm); MF: JST Sales America Inc.; MP: B5B-XH-A(LF)(SN); Value: *; Availability: In Stock; Package: None; Purchase-URL: https://pricing.snapeda.com/search/part/B5B-XH-A(LF)(SN)/?ref=eda; Price: None; SnapEDA_Link: https://www.snapeda.com/parts/B5B-XH-A(LF)(SN)/JST+Sales+America+Inc./view-part/?ref=snap; Check_prices: https://www.snapeda.com/parts/B5B-XH-A(LF)(SN)/JST+Sales+America+Inc./view-part/?ref=eda
J7 J8 = B4B-XH-A(LF)(SN): Connector Header Through Hole 4 position 0.098 (2.50mm); MF: JST Sales; SnapEDA_Link: https://www.snapeda.com/parts/B4B-XH-A(LF)(SN)/JST+Sales+America+Inc./view-part/?ref=snap; Package: None; MP: B4B-XH-A(LF)(SN); Check_prices: https://www.snapeda.com/parts/B4B-XH-A(LF)(SN)/JST+Sales+America+Inc./view-part/?ref=eda; Purchase-URL: https://pricing.snapeda.com/search/part/B4B-XH-A(LF)(SN)/?ref=eda; Price: None; Value: *; Availability: In Stock
R1-R4 = 0402 10K (1002) 1%: as R5 on sheet CAN; ComponentLink1Description: Supplier link; ComponentLink1URL: http://www.szlcsc.com/product/details_26487.html; Package: 0402; Supplier: LC; SuppliersPartNumber: C25744; Resistance: 10KΩ; Tolerance: 1%

## Nets that join several sheets
GND: GPIO (8 pins), CAN (7 pins), CurrentSens (7 pins), Power (13 pins), Connectors (9 pins)
VCC3V3: GPIO (RPI1.1 RPI1.17), CAN (5 pins), CurrentSens (U4.15 U4.16 U5.12), Connectors (5 pins)
VCC5V1: GPIO (RPI1.2 RPI1.4), CurrentSens (U5.3-4), Connectors (J2.1)
VCC5V1-UM: CurrentSens (U5.1-2), Power (6 pins)
VCCGLV: Power (7 pins), Connectors (J1.1)
CAN1_N: CAN (R7.1 U1.6), Connectors (J12.1)
CAN1_P: CAN (J15.1 U1.7), Connectors (J12.2)
GPIO4: GPIO (RPI1.7), Connectors (J5.1)
GPIO5: GPIO (RPI1.29), Connectors (J5.2)
GPIO6: GPIO (RPI1.31), Connectors (J5.3)
GPIO12: GPIO (RPI1.32), Connectors (J5.4)
GPIO16: GPIO (RPI1.36), Connectors (J6.1)
GPIO19: GPIO (RPI1.33), Connectors (J6.2)
GPIO22: GPIO (RPI1.15), Connectors (J6.3)
GPIO23: GPIO (RPI1.16), Connectors (J6.4)
GPIO24: GPIO (RPI1.18), Connectors (J9.1 R1.1)
GPIO25: GPIO (RPI1.22), Connectors (J10.1 R2.1)
GPIO26: GPIO (RPI1.37), Connectors (J13.1 R3.1)
GPIO27: GPIO (RPI1.13), Connectors (J14.1 R4.1)
I2C0_SCL: GPIO (RPI1.5), Connectors (J4.2)
I2C0_SDA: GPIO (RPI1.3), Connectors (J4.1)
SPI0_CE0_N: GPIO (RPI1.24), CAN (U2.18)
SPI0_CE1_N: GPIO (RPI1.26), Connectors (J7.2)
SPI0_MISO: GPIO (RPI1.21), CAN (U2.17), Connectors (J7.3)
SPI0_MOSI: GPIO (RPI1.19), CAN (U2.16), Connectors (J7.4)
SPI0_SCLK: GPIO (RPI1.23), CAN (U2.14), Connectors (J7.1)
SPI01_CE0_N: GPIO (RPI1.12), CurrentSens (U4.10)
SPI1_CE1_N: GPIO (RPI1.11), Connectors (J8.2)
SPI1_MISO: GPIO (RPI1.35), CurrentSens (U4.12), Connectors (J8.3)
SPI1_MOSI: GPIO (RPI1.38), CurrentSens (U4.11), Connectors (J8.4)
SPI1_SCLK: GPIO (RPI1.40), CurrentSens (U4.13), Connectors (J8.1)
UART_RX: GPIO (RPI1.10), Connectors (J11.2)
UART_TX: GPIO (RPI1.8), Connectors (J11.1)